# EAGLE design latch6 (EAGLE 8.3.1)
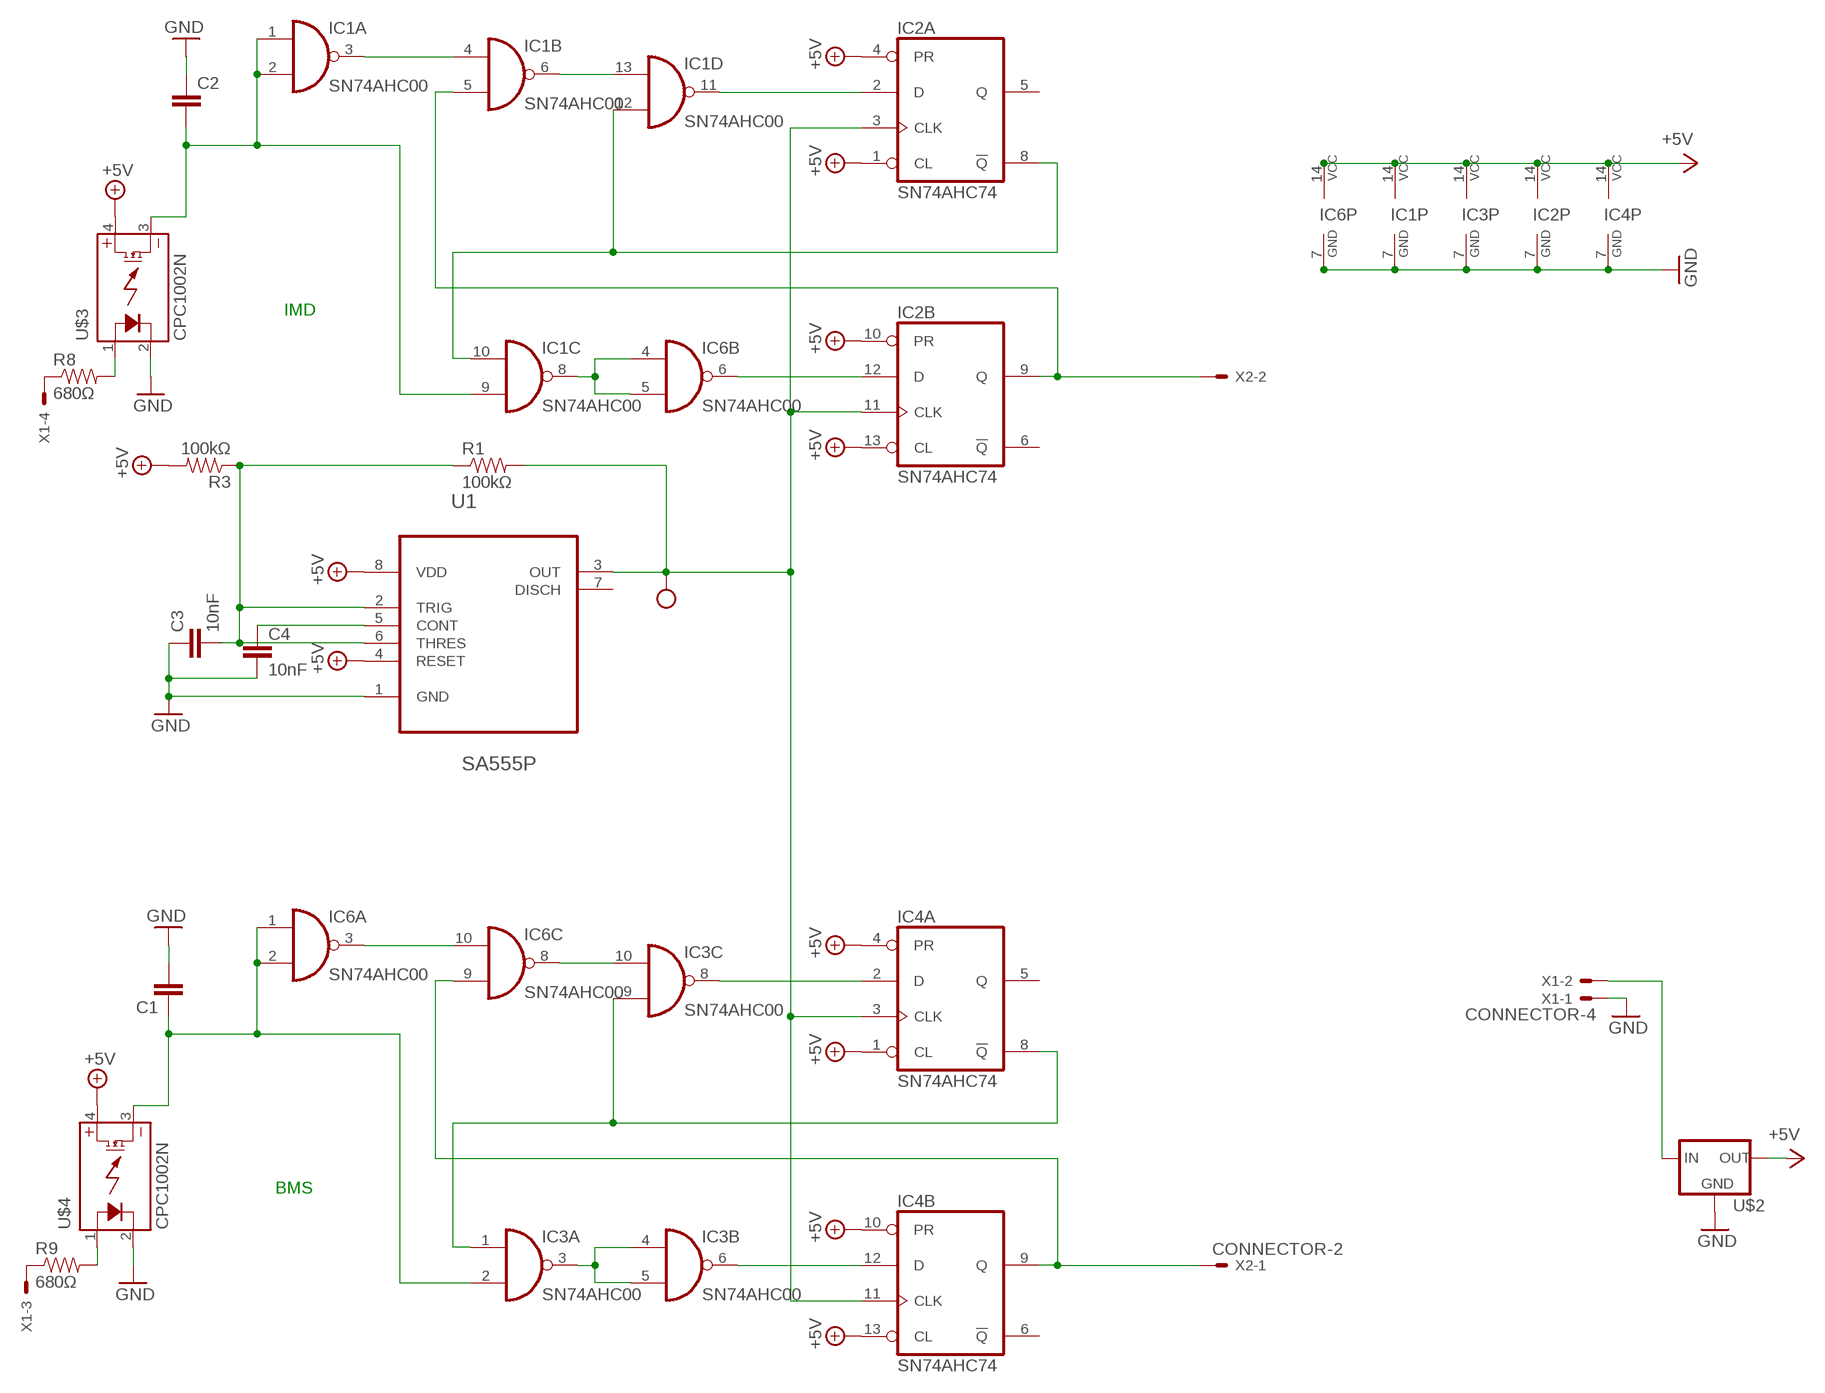
[diagram p0: schematic, sheet 1]

## Parts
C1  CAP_  [AXIAL-5MM]
C2  CAP_  [AXIAL-5MM]
C3  10nF  CAP_  [AXIAL-5MM]
C4  10nF  CAP_  [AXIAL-5MM]
IC1  SN74AHC00  [DIL14]
IC2  SN74AHC74  [DIL14]
IC3  SN74AHC00  [DIL14]
IC4  SN74AHC74  [DIL14]
IC6  SN74AHC00  [DIL14]
R1  100kΩ  RESISTORPTH-1/4W  [AXIAL-0.4]
R3  100kΩ  RESISTORPTH-1/4W  [AXIAL-0.4]
R8  680Ω  RESISTORPTH-1/4W  [AXIAL-0.4]
R9  680Ω  RESISTORPTH-1/4W  [AXIAL-0.4]
U1  SA555P  [DIP254P762X508-8]
U$1  TEST_POINT  [TEST_POINT]
U$2  5VREG_LM340-NLM340T-5.0/NOPB  [TO-220]
U$3  CPC1002N  [SOP04]
U$4  CPC1002N  [SOP04]
X1  CONNECTOR-4  [MINIFIT_5566-4]
X2  CONNECTOR-2  [MINIFIT_5566-2]

## Nets
12V: U$2.1(IN) X1.2
+5V: IC1.14(P:VCC) IC2.1(A:CL) IC2.4(A:PR) IC2.10(B:PR) IC2.13(B:CL) IC2.14(P:VCC) IC3.14(P:VCC) IC4.1(A:CL) IC4.4(A:PR) IC4.10(B:PR) IC4.13(B:CL) IC4.14(P:VCC) IC6.14(P:VCC) R3.P$2 U1.4(RESET) U1.8(VDD) U$2.3(OUT) U$3.4(DC+) U$4.4(DC+)
BMS_5V: C1.P$1 IC3.2(A:I1) IC6.1(A:I0) IC6.2(A:I1) U$4.3(DC-)
BMS_IN: R9.P$2 U$4.1(CONTROL+)
BMS_OUT: IC4.9(B:Q) IC6.9(C:I1) X2.1
CLK: IC2.3(A:CLK) IC2.11(B:CLK) IC4.3(A:CLK) IC4.11(B:CLK) R1.P$2 U1.3(OUT) U$1.P$1
GND: C1.P$2 C2.P$1 C3.P$1 C4.P$2 IC1.7(P:GND) IC2.7(P:GND) IC3.7(P:GND) IC4.7(P:GND) IC6.7(P:GND) U1.1(GND) U$2.2(GND) U$3.2(CONTROL-) U$4.2(CONTROL-) X1.1
IMD_5V: C2.P$2 IC1.1(A:I0) IC1.2(A:I1) IC1.9(C:I1) U$3.3(DC-)
IMD_IN: R8.P$2 U$3.1(CONTROL+)
IMD_OUT: IC1.5(B:I1) IC2.9(B:Q) X2.2
N$2: IC1.3(A:O) IC1.4(B:I0)
N$3: C3.P$2 R1.P$1 R3.P$1 U1.2(TRIG) U1.6(THRES)
N$4: IC1.6(B:O) IC1.13(D:I0)
N$5: IC1.10(C:I0) IC1.12(D:I1) IC2.8(A:!Q)
N$6: IC1.11(D:O) IC2.2(A:D)
N$7: C4.P$1 U1.5(CONT)
N$8: IC2.12(B:D) IC6.6(B:O)
N$10: IC3.6(B:O) IC4.12(B:D)
N$11: IC1.8(C:O) IC6.4(B:I0) IC6.5(B:I1)
N$20: IC6.3(A:O) IC6.10(C:I0)
N$21: IC3.10(C:I0) IC6.8(C:O)
N$22: IC3.1(A:I0) IC3.9(C:I1) IC4.8(A:!Q)
N$23: IC3.8(C:O) IC4.2(A:D)
N$25: IC3.3(A:O) IC3.4(B:I0) IC3.5(B:I1)
N$32: R8.P$1 X1.4
N$33: R9.P$1 X1.3
Unconnected: IC2.5(A:Q) IC2.6(B:!Q) IC3.11(D:O) IC3.12(D:I1) IC3.13(D:I0) IC4.5(A:Q) IC4.6(B:!Q) IC6.11(D:O) IC6.12(D:I1) IC6.13(D:I0) U1.7(DISCH)

## Notes on the sheet
- IMD
- BMS

## Library data of the parts
C1-C4 = HyTechDevices:CAP: Capacitor Standard 0603 ceramic capacitor, and 0.1" leaded capacitor.
IC1 IC3 IC6 = HyTechDevices:SN74AHC00: TI SN74AHC00 Quadruple 2-input NAND
IC2 IC4 = HyTechDevices:SN74AHC74: TI SN74AHC74 Dual positive edge triggered D-type FLIP FLOP
R1 R3 R8 R9 = HyTechDevices:RESISTOR: Resistor Basic schematic elements and footprints for 0603, 1206, and PTH resistors.
U1 = Texas Instruments:SA555P: PRECISION TIMERS; MPN: SA555P; OC_FARNELL: 1755013; OC_NEWARK: 08F4502; PACKAGE: PDIP-8; SUPPLIER: Texas Instruments
U$1 = HyTechDevices:TEST_POINT: Keystone Electronics Test Point 5005
U$2 = HyTechDevices:5VREG_LM340-N: Voltage Regulator 5v linear voltage regulator Datasheet <http://www.mouser.com/ProductDetail/Texas-Instruments/LM340MPX-50-NOPB/?qs=X1J7HmVL2ZGZwtTFRQ9ItA%3D%3D> MAX current out: 1.5A MAX voltage in: 35V
U$3 U$4 = HyTechDevices:CPC1002N: IXYS Solid State Relay .7A
X1 = HyTechDevices:CONNECTOR-4: Mini-Fit Junior connector 4 pole Source: http://www.molex.com; OC_FARNELL: unknown; OC_NEWARK: unknown
X2 = HyTechDevices:CONNECTOR-2: Mini-Fit Junior connector 2 pole Source: http://www.molex.com; OC_FARNELL: 1822072; OC_NEWARK: unknown

## Net classes
0 default: width 0.406 mm, drill 0.406 mm, clearance 0.406 mm

## Board
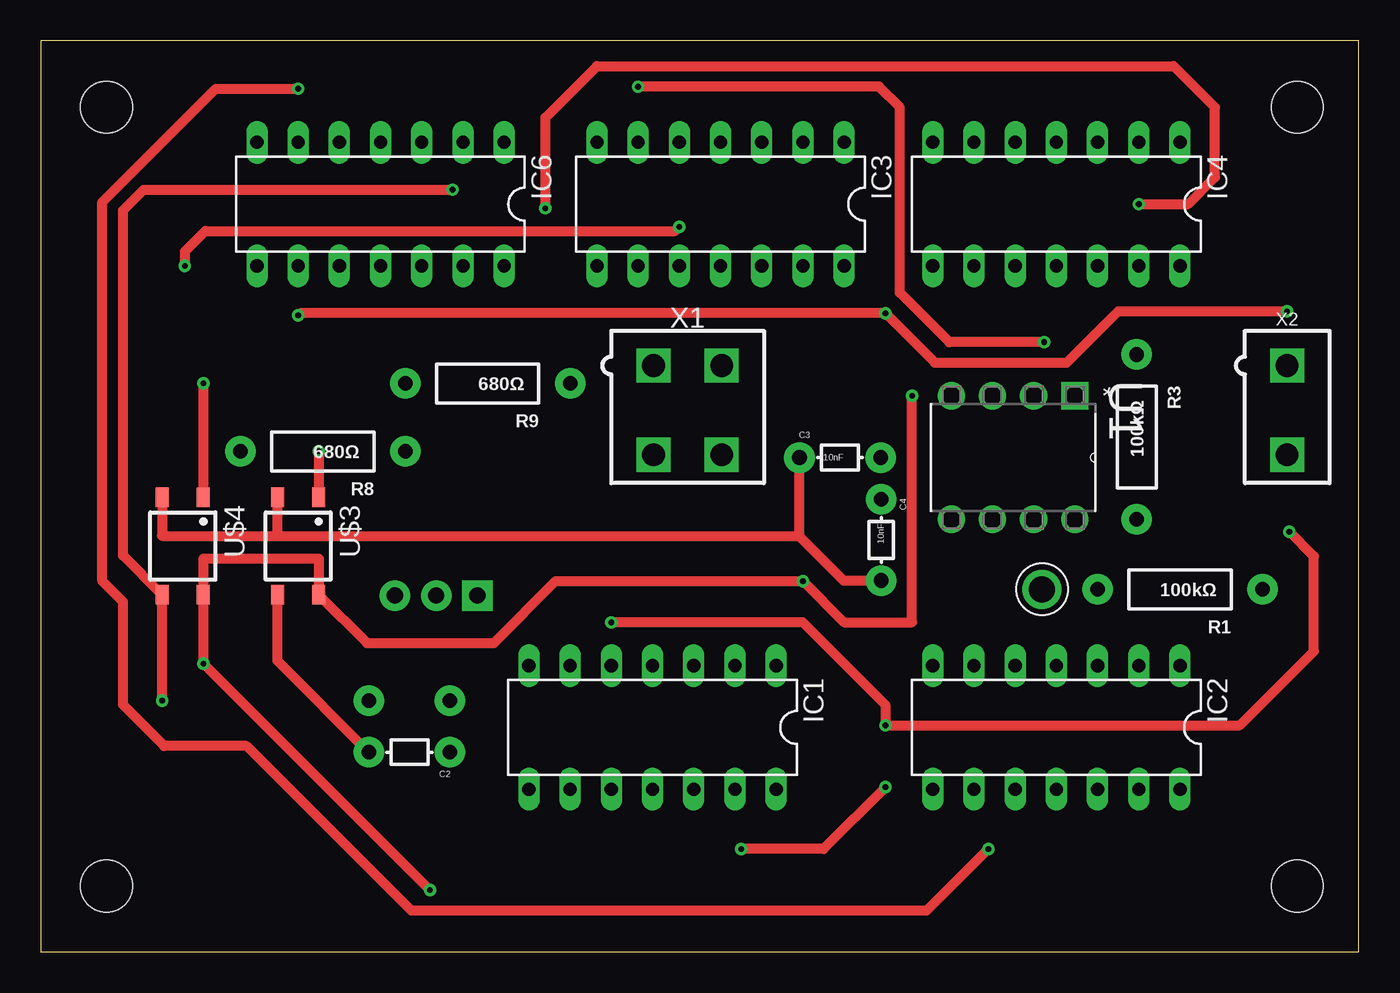
[diagram p1: board, top side]
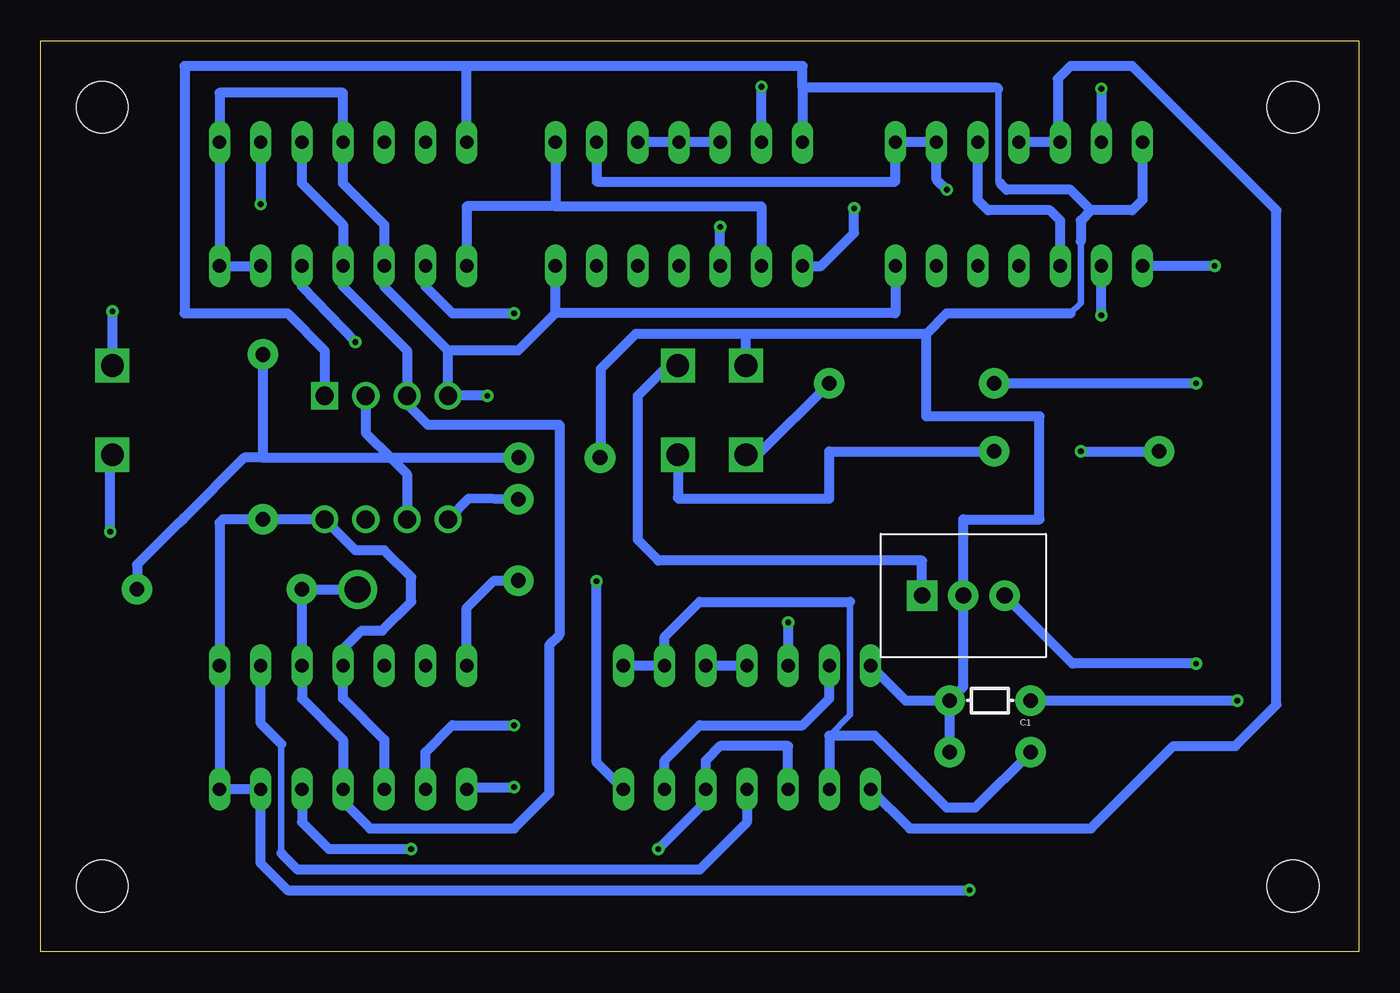
[diagram p2: board, bottom side, seen from below]

Size 81.26 x 56.19 mm. Coordinates in mm from the lower left corner, seen from the top.
Outline: 0,0 81.26,0 81.26,56.19 0,56.19 0,0
Copper layers (1*16): Top 0.035mm / dielectric 1.5mm / Bottom 0.035mm
Design rules "default *": minimum track width 6mil, minimum drill 0.35mm, track to track 16mil, track to pad 16mil, pad to pad 16mil, via to via 16mil, smd to smd 16mil, copper to edge 40mil, drill to drill 6mil, minimum pad ring 10mil, minimum via ring 8mil, stop-mask expansion 4mil, vias tented up to drill 0mil, thermal gap 10mil
Holes 3.17 mm at 4.06,4.06 4.06,52.07 77.47,52.07 77.47,4.06

### Footprints (pad centres in the part's own frame; a part is rotated, then mirrored left to right if it is on the bottom)
AXIAL-5MM = drill 0.9 pad 1.88: P$1 -2.5,0; P$2 2.5,0
DIL14 = drill 0.813 long: 1 -7.62,-3.81; 2 -5.08,-3.81; 3 -2.54,-3.81; 4 0,-3.81; 5 2.54,-3.81; 6 5.08,-3.81; 7 7.62,-3.81; 8 7.62,3.81; 9 5.08,3.81; 10 2.54,3.81; 11 0,3.81; 12 -2.54,3.81; 13 -5.08,3.81; 14 -7.62,3.81
AXIAL-0.4 = drill 0.9 pad 1.88: P$1 -5.08,0; P$2 5.08,0
DIP254P762X508-8 = drill 1.118 square: 1 -7.62,7.62 | drill 1.118: 2 -7.62,5.08; 3 -7.62,2.54; 4 -7.62,0; 5 0,0; 6 0,2.54; 7 0,5.08; 8 0,7.62
TEST_POINT = drill 1.6: P$1 0,0
TO-220 = drill 1 pad 1.88 square: 1 -2.54,0 | drill 1 pad 1.88: 2 0,0; 3 2.54,0
SOP04 = smd 0.8 x 1.2: 1 -1.27,-3; 2 1.27,-3; 3 1.27,3; 4 -1.27,3
MINIFIT_5566-4 = drill 1.4 square: 1 2.1,-2.75; 2 -2.1,-2.75; 3 2.1,2.75; 4 -2.1,2.75
MINIFIT_5566-2 = drill 1.4 square: 1 0,-2.75; 2 0,2.75

### Placement (x,y rotation side)
C1  22.73,15.49 180 bottom
C2  22.73,12.32 180 top
C3  49.28,30.48 0 top
C4  51.82,25.4 270 top
IC1  37.72,13.84 180 top
IC2  62.61,13.84 180 top
IC3  41.91,46.1 180 top
IC4  62.61,46.1 180 top
IC6  20.95,46.1 180 top
R1  70.23,22.35 180 top
R3  67.56,31.75 270 top
R8  17.4,30.86 180 top
R9  27.56,35.05 180 top
U1  56.13,26.67 270 top
U$1  61.72,22.35 0 top
U$2  24.38,21.97 0 bottom
U$3  15.88,25.02 180 top
U$4  8.76,25.02 180 top
X1  39.88,33.4 180 top
X2  76.83,33.4 180 top

### Tracks (layer width: path | path; a pad name or v marks a point on that pad's centre or on a via)
12V
  Bottom 0.61: U$2.1 26.92,24.13 43.18,24.13 44.45,25.4 44.45,34.29 42.59,36.15 X1.2
+5V  (via drill 0.35)
  Top 0.61: v53.72,34.29 53.72,20.32 49.53,20.32 v46.99,22.86 31.75,22.86 27.94,19.05 20.11,19.05 U$3.4 17.14,24.26 10.03,24.26 U$4.4 v10.03,17.78 v24,3.81
  Bottom 0.61: IC4.14 IC4.1 70.23,52.96 62.61,52.96 IC4.4 62.61,47.37 60.07,44.83 IC4.10 60.07,41.02 56.13,37.08 56.13,37.05 | IC4.14 IC4.13 | IC4.14 70.1,42.16 | IC2.10 60.07,13.08 62.61,15.62 IC2.4 62.61,18.67 61.47,19.81 60.2,19.81 58.42,21.59 58.42,23.11 60.07,24.77 61.85,24.77 U1.8 R3.P$2 70.03,26.67 70.23,26.47 IC2.1 IC2.14 IC2.13 67.69,5.46 66.04,3.81 v24,3.81 | 49.53,39.37 IC3.14 | 49.53,39.37 51.82,37.08 55.92,37.08 56.13,37.05 | IC6.14 28.57,39.37 49.53,39.37 | U$2.3 17.65,17.78 v10.03,17.78 | v53.72,34.29 U1.4 56.13,37.05 | IC1.14 46.99,11.68 v46.99,22.86
BMS_5V  (via drill 0.35)
  Top 0.61: v7.49,15.49 U$4.3 5.08,24.43 5.08,45.72 6.35,46.99 v25.4,46.99
  Bottom 0.61: IC3.2 46.99,47.5 28.57,47.5 IC6.1 IC6.2 26.04,47.62 v25.4,46.99 | C1.P$1 v7.49,15.49
BMS_IN  (via drill 0.35)
  Top 0.61: v10.03,35.05 U$4.1
  Bottom 0.61: v10.03,35.05 R9.P$2
BMS_OUT  (via drill 0.35)
  Top 0.61: v76.83,39.5 66.42,39.5 63.25,36.32 55.12,36.32 v52.07,39.37 16,39.37 v15.88,39.24
  Bottom 0.61: IC4.9 57.53,41.02 55.88,39.37 v52.07,39.37 | v76.83,39.5 X2.1 | v15.88,39.24 IC6.9
CLK
  Bottom 0.61: IC4.3 65.15,47.37 62.61,44.83 IC4.11 62.61,41.02 58.67,37.08 U1.3 58.67,33.78 57.4,32.51 49.28,32.51 49.28,19.56 49.91,18.92 49.91,9.78 52.07,7.62 60.96,7.62 62.61,9.27 IC2.11 62.61,13.08 65.15,15.62 IC2.3 R1.P$2 U$1.P$1
GND
  Top 0.61: U$4.2 7.49,25.65 14.61,25.65 | 14.61,25.65 U$3.2 | 14.61,25.65 46.74,25.65 | 46.74,25.65 arc-90 46.78,25.61 49.49,22.9 C4.P$2 | 46.74,25.65 46.78,25.69 C3.P$1
  Bottom 0.406: 17.14,43.81 17.14,40.01 17.78,39.37 | 22.1,47.37 22.23,47.5 22.23,53.21
  Bottom 0.61: IC4.7 54.99,54.61 | U1.1 63.75,37.08 66.04,39.37 72.39,39.37 72.39,54.61 54.99,54.61 | 54.99,54.61 34.29,54.61 34.29,53.27 | IC3.7 34.29,53.27 | C3.P$1 46.74,30.52 46.74,35.94 44.58,38.1 37.6,38.1 | 17.78,39.37 25.4,39.37 26.67,38.1 | 26.67,38.1 37.6,38.1 | X1.1 37.78,37.92 37.6,38.1 | 16.51,45.72 17.14,45.09 17.14,43.81 | IC6.7 13.34,46.35 13.97,45.72 16.51,45.72 | IC2.7 54.99,21.21 53.3,22.9 C4.P$2 | 16.51,45.72 17.78,46.99 21.72,46.99 22.1,47.37 | 22.23,53.21 22.28,53.27 34.29,53.27 | 26.67,38.1 26.67,33.02 19.68,33.02 19.68,26.67 24.38,26.67 U$2.2 24.38,16.34 C1.P$2 | C1.P$2 C2.P$1 | IC1.7 27.94,15.49 C1.P$2
IMD_5V
  Top 0.61: C2.P$2 14.61,17.95 U$3.3
  Bottom 0.406: 31.37,21.59 31.37,14.61 32.64,13.34
  Bottom 0.61: IC1.1 IC1.2 42.8,19.43 40.64,21.59 31.37,21.59 | IC1.9 32.64,13.34 29.84,13.34 25.4,8.89 23.66,8.89 C2.P$2
IMD_IN  (via drill 0.35)
  Top 0.61: v17.14,30.86 U$3.1
  Bottom 0.61: v17.14,30.86 R8.P$2
IMD_OUT  (via drill 0.35)
  Top 0.61: v35.18,20.32 46.99,20.32 52.07,15.24 v52.07,13.97 73.91,13.97 78.49,18.54 78.49,24.38 v76.96,25.91
  Bottom 0.61: IC2.9 57.53,12.32 55.88,13.97 v52.07,13.97 | v35.18,20.32 IC1.5 | v76.96,25.91 76.96,30.52 X2.2
N$2
  Bottom 0.61: IC1.3 IC1.4
N$3
  Bottom 0.61: U1.6 58.67,29.46 59.69,30.48 | U1.2 61.21,32 59.69,30.48 | 67.55,30.48 68.71,30.48 72.45,26.73 72.77,26.42 75.31,23.88 R1.P$1 | 67.55,30.48 59.69,30.48 | 67.55,30.48 67.56,30.5 R3.P$1 | 59.69,30.48 C3.P$2
N$4
  Bottom 0.61: IC1.13 42.8,11.81 40.64,13.97 34.29,13.97 32.64,15.62 IC1.6
N$5  (via drill 0.35)
  Top 0.61: v52.07,10.16 48.26,6.35 v43.18,6.35
  Bottom 0.61: IC1.10 35.18,12.7 39.37,12.7 40.26,11.81 IC1.12 40.26,9.27 v43.18,6.35 | IC2.8 54.86,10.16 v52.07,10.16
N$6
  Bottom 0.406: 66.42,6.1 66.42,12.83
  Bottom 0.61: 66.42,12.83 67.69,14.1 IC2.2 | 66.42,6.1 65.41,5.08 40.64,5.08 37.72,8 IC1.11
N$7
  Bottom 0.61: C4.P$1 54.86,27.94 U1.5
N$8  (via drill 0.35)
  Top 0.61: v58.42,6.35 54.61,2.54 22.86,2.54 12.7,12.7 7.62,12.7 5.08,15.24 5.08,21.59 3.81,22.86 3.81,46.23 10.79,53.21 v15.88,53.21
  Bottom 0.61: IC2.12 65.15,8 63.5,6.35 v58.42,6.35 | v15.88,53.21 IC6.6
N$10  (via drill 0.35)
  Top 0.61: v61.85,37.59 56.01,37.59 52.96,40.64 52.96,52.07 51.69,53.34 v36.83,53.34
  Bottom 0.61: IC4.12 65.15,41.02 v61.85,37.59 | IC3.6 v36.83,53.34
N$11
  Bottom 0.61: 18.56,49.91 IC6.4 | 18.56,49.91 IC6.5 | IC1.8 27.69,7.62 16.51,7.62 11.43,12.7 7.62,12.7 5.08,15.24 5.08,45.72 13.97,54.61 17.78,54.61 18.56,53.83 18.56,49.91
N$20
  Bottom 0.61: IC6.10 18.41,45.09 19.05,45.72 22.86,45.72 23.5,46.35 IC6.3
N$21  (via drill 0.35)
  Top 0.61: v8.89,42.29 8.89,43.18 10.16,44.45 39.12,44.45 v39.37,44.7
  Bottom 0.61: IC3.10 v39.37,44.7 | v8.89,42.29 IC6.8
N$22
  Bottom 0.61: IC3.1 49.53,45.97 | 49.53,45.97 54.99,45.97 IC4.8 | 49.53,45.97 36.83,45.97 IC3.9
N$23  (via drill 0.35)
  Top 0.61: v67.69,46.1 70.74,46.1 72.39,47.75 72.39,52.07 69.85,54.61 34.29,54.61 31.11,51.44 v31.11,45.85
  Bottom 0.61: IC4.2 v67.69,46.1 | IC3.8 33.15,42.29 31.11,44.32 v31.11,45.85
N$25
  Bottom 0.61: IC3.5 IC3.4 IC3.3
N$32
  Bottom 0.61: X1.4 41.98,28.01 41.91,27.94 32.64,27.94 32.64,30.86 R8.P$1
N$33
  Bottom 0.61: R9.P$1 37.04,30.65 X1.3